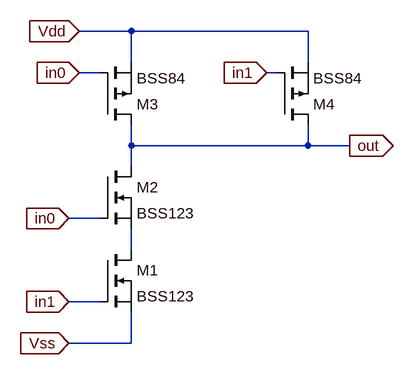
[diagram p0: schematic nand.asc]
nand.asc, the LTspice schematic file:
Version 4
SHEET 1 984 680
WIRE 160 -288 80 -288
WIRE 432 -288 160 -288
WIRE 160 -240 160 -288
WIRE 432 -240 432 -288
WIRE 112 -224 80 -224
WIRE 384 -224 368 -224
WIRE 160 -112 160 -144
WIRE 432 -112 432 -144
WIRE 432 -112 160 -112
WIRE 496 -112 432 -112
WIRE 160 -80 160 -112
WIRE 112 0 64 0
WIRE 160 48 160 16
WIRE 112 128 64 128
WIRE 160 192 160 144
WIRE 160 192 64 192
FLAG 64 0 in0
IOPIN 64 0 In
FLAG 496 -112 out
IOPIN 496 -112 Out
FLAG 64 192 Vss
IOPIN 64 192 In
FLAG 64 128 in1
IOPIN 64 128 In
FLAG 80 -288 Vdd
IOPIN 80 -288 In
FLAG 80 -224 in0
IOPIN 80 -224 In
FLAG 368 -224 in1
IOPIN 368 -224 In
SYMBOL nmos 112 48 R0
SYMATTR InstName M1
SYMATTR Value BSS123
SYMBOL nmos 112 -80 R0
SYMATTR InstName M2
SYMATTR Value BSS123
SYMBOL pmos 112 -144 M180
SYMATTR InstName M3
SYMATTR Value BSS84
SYMBOL pmos 384 -144 M180
SYMATTR InstName M4
SYMATTR Value BSS84

The netlist it stands for:
* nand.asc
M1 N001 in1 Vss Vss BSS123
M2 out in0 N001 N001 BSS123
M3 out in0 Vdd Vdd BSS84
M4 out in1 Vdd Vdd BSS84
.model NMOS NMOS
.model PMOS PMOS
.lib standard.mos
.backanno
.end